# Altium schematic sheet Management_RP2040_Support.SchDoc: Management Microcontroller Support
size B; CheckedBy: Jason Sullins; Author: Jordan Harris-Toovy; Revision: 0.2; SheetNumber: 3; SheetTotal: 22; Size: ANSI B
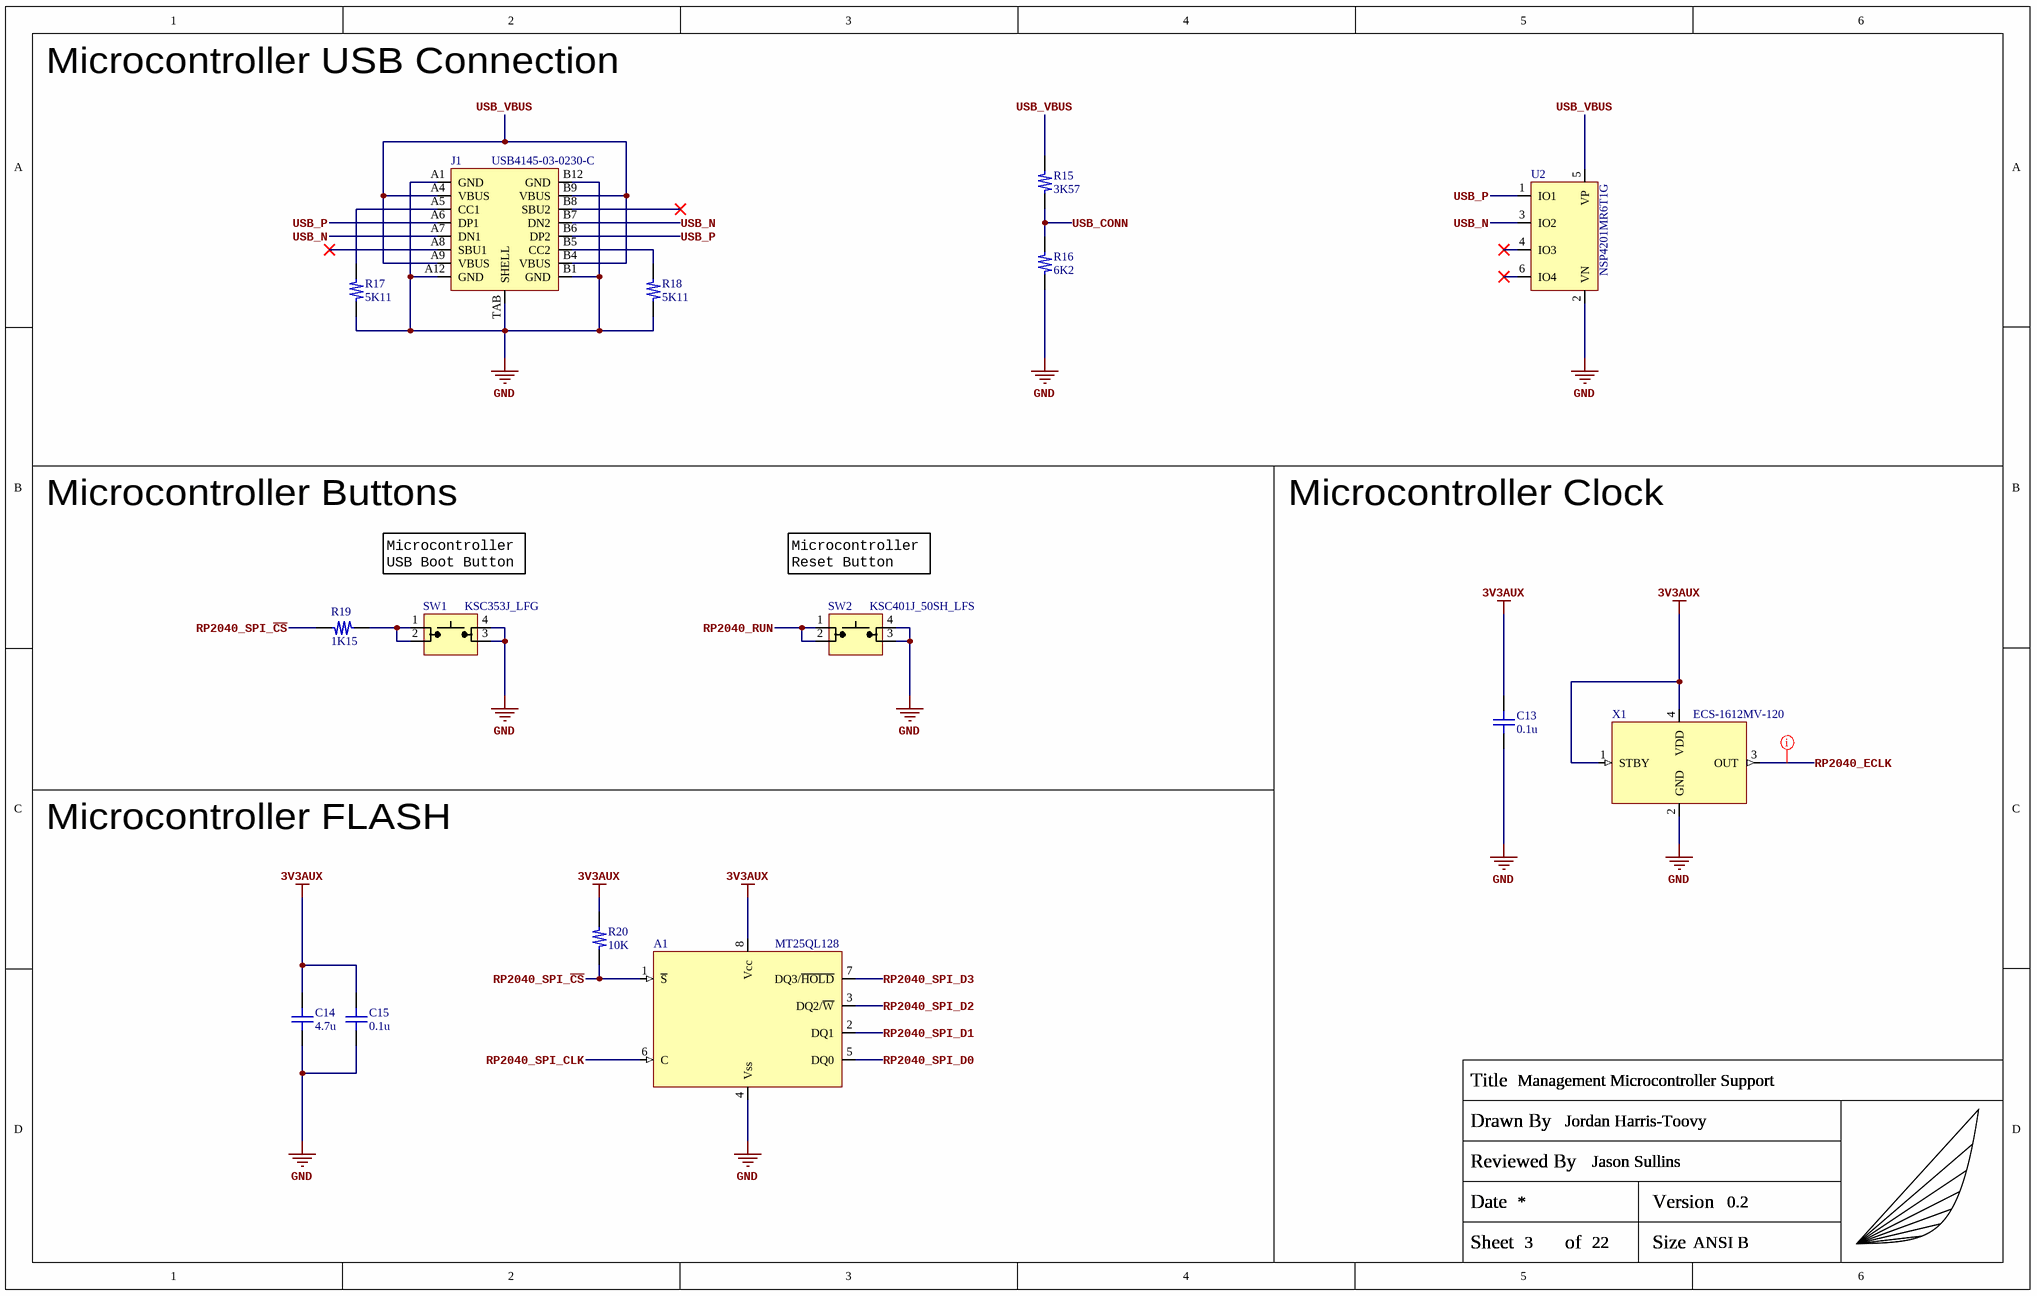
[diagram p0: Management_RP2040_Support.SchDoc]

## Parts
A1  MT25QL128  [LOTES_ACA-SPI-004-K01]
C13  0.1u  [C_0402_Generic]
C14  4.7u  [C_0402_Generic]
C15  0.1u  [C_0402_Generic]
J1  USB4145-03-0230-C  [USB4145-03-0230-C]
R15  3K57  [R_0402_Generic]
R16  6K2  [R_0402_Generic]
R17  5K11  [R_0402_Generic]
R18  5K11  [R_0402_Generic]
R19  1K15  [R_0402_Generic]
R20  10K  [R_0402_Generic]
SW1  KSC353J_LFG  [C&K_KSC_6.20]
SW2  KSC401J_50SH_LFS  [C&K_KSC_6.20]
TITLEBLOCK?  Capstone_Title_Block  (value not drawn)  (graphical)
U2  NSP4201MR6T1G  [ONSEMI_6-TSOP]
X1  ECS-1612MV-120  [ECS 4-SMD (1.6X1.2)]

## Nets
3V3AUX: A1.8(Vcc) C13.2 C14.2 C15.2 R20.2 X1.1(STBY) X1.4(VDD)
GND: A1.4(Vss) C13.1 C14.1 C15.1 J1.A1(GND) J1.A12(GND) J1.B1(GND) J1.B12(GND) J1.TAB(SHELL) R16.1 R17.1 R18.1 SW1.3(P3) SW1.4(P4) SW2.3(P3) SW2.4(P4) U2.2(VN) X1.2(GND)
RP2040_ECLK: X1.3(OUT)
RP2040_RUN: SW2.1(P1) SW2.2(P2)
RP2040_SPI_~{CS}: A1.1(~{S}) R19.2 R20.1
RP2040_SPI_CLK: A1.6(C)
RP2040_SPI_D0: A1.5(DQ0)
RP2040_SPI_D1: A1.2(DQ1)
RP2040_SPI_D2: A1.3(DQ2/~{W})
RP2040_SPI_D3: A1.7(DQ3/~{HOLD})
USB_CONN: R15.1 R16.2
USB_N: J1.A7(DN1) J1.B7(DN2) U2.3(IO2)
USB_P: J1.A6(DP1) J1.B6(DP2) U2.1(IO1)
USB_VBUS: J1.A4(VBUS) J1.A9(VBUS) J1.B4(VBUS) J1.B9(VBUS) R15.2 U2.5(VP)
NetJ1_A5: J1.A5(CC1) R17.2
NetJ1_B5: J1.B5(CC2) R18.2
NetR19_1: R19.1 SW1.1(P1) SW1.2(P2)

Not connected (* = marked no-connect by the designer): J1 A8(SBU1)* B8(SBU2)*; U2 4(IO3)* 6(IO4)*

## Layout directives
net class SE50_GENERAL: RP2040_ECLK

## Notes on the sheet
- Microcontroller USB Connection
- Microcontroller Buttons
- Microcontroller Clock
- Microcontroller USB Boot Button
- Microcontroller Reset Button
- Microcontroller FLASH
- (in symbol Capstone_Title_Block) Title; Drawn By; Reviewed By; Date; Version; Sheet; of; Size

## Library data of the parts
A1 = MT25QL128ABA1ESE_ACA-SPI-004: FLASH - NOR Memory IC 128Mbit SPI (Q)SPI 133 MHz 8-SO In ACA-SPI-004-K01 socket; Manufacturer: Micron Technology Inc; Manufacturer Part Number: MT25QL128ABA1ESE; Manufacturer2: LOTES; Manufacturer2 Part Number: ACA-SPI-004-K01
C13 C15 = GRM155R71C104KA88D: 0.1µF 16V X7R SMD ceramic capacitor in 0402 size; Manufacturer: Murata Electronics; Manufacturer Part Number: GRM155R71C104KA88D
C14 = GRM155R61A475MEAAJ: 4.7µF 10V X5R SMD ceramic capacitor in 0402 size; Manufacturer: Murata Electronics; Manufacturer Part Number: GRM155R61A475MEAAJ
J1 = USB4145-03-0230-C: USB 2.0 TYPE-C RECPT VERT XL TABS SMT; Manufacturer: GCT; Manufacturer Part Number: USB4145-03-0230-C
R15 = ERJ-2RKF3571X: 3.57KOhm 1% 1/10W SMD resistor in 0402 size; Manufacturer: Panasonic; Manufacturer Part Number: ERJ-2RKF3571X
R16 = ERJ-2RKF6201X: 6.2KOhm 1% 1/10W SMD resistor in 0402 size; Manufacturer: Panasonic; Manufacturer Part Number: ERJ-2RKF6201X
R17 R18 = ERJ-2RKF5111X: 5.11KOhm 1% 1/10W SMD resistor in 0402 size; Manufacturer: Panasonic; Manufacturer Part Number: ERJ-2RKF5111X
R19 = ERJ-2RKF1151X: 1.15KOhm 1% 1/10W SMD resistor in 0402 size; Manufacturer: Panasonic; Manufacturer Part Number: ERJ-2RKF1151X
R20 = ERJ-2RKF1002X: 10KOhm 1% 1/10W SMD resistor in 0402 size; Manufacturer: Panasonic; Manufacturer Part Number: ERJ-2RKF1002X
SW1 = KSC353J_LFG: Tactile Switch SPST-NO (MOM) SMD back actuator; Manufacturer: C&K; Manufacturer Part Number: KSC353J LFG
SW2 = KSC401J_50SH_LFS: Tactile Switch SPST-NO (MOM) SMD red long actuator; Manufacturer: C&K; Manufacturer Part Number: KSC401J 50SH LFS
TITLEBLOCK? = Capstone_Title_Block: Custom title block with personal logo; Manufacturer: NONE; Manufacturer Part Number: NONE
U2 = NSP4201MR6T1G: 4CH 6V Break 12V Clamp TVS Diode USB; Manufacturer: onsemi; Manufacturer Part Number: NSP4201MR6T1G
X1 = ECS-1612MV-120-CN-TR: 12 MHz XO (Standard) CMOS Oscillator 1.6V ~ 3.63V Standby (Power Down) 4-SMD, No Lead; Manufacturer: ECS Inc; Manufacturer Part Number: ECS-1612MV-120-CN-TR